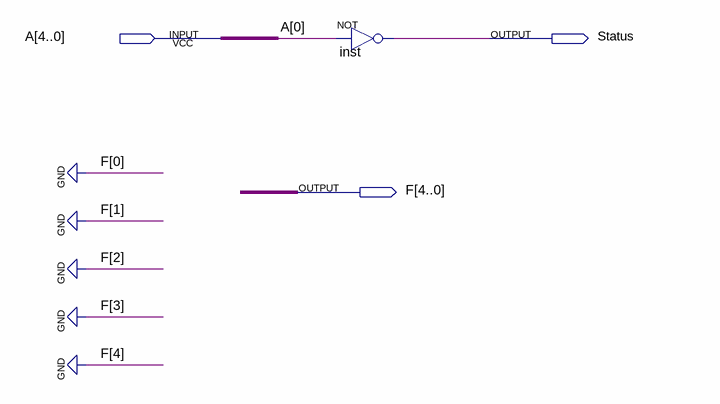
[diagram p0: schematic sheet]
// Quartus schematic Status_par.bdf as structural Verilog: 1 symbols, 3 pins
module Status_par (
  input  [4:0] A,
  output Status,
  output [4:0] F
);

  not inst (Status, A[0]);

  assign F = {5{1'b0}};
endmodule
